# Altium schematic sheet UART Debug.SchDoc
size A4; SheetNumber: 2; SheetTotal: 12
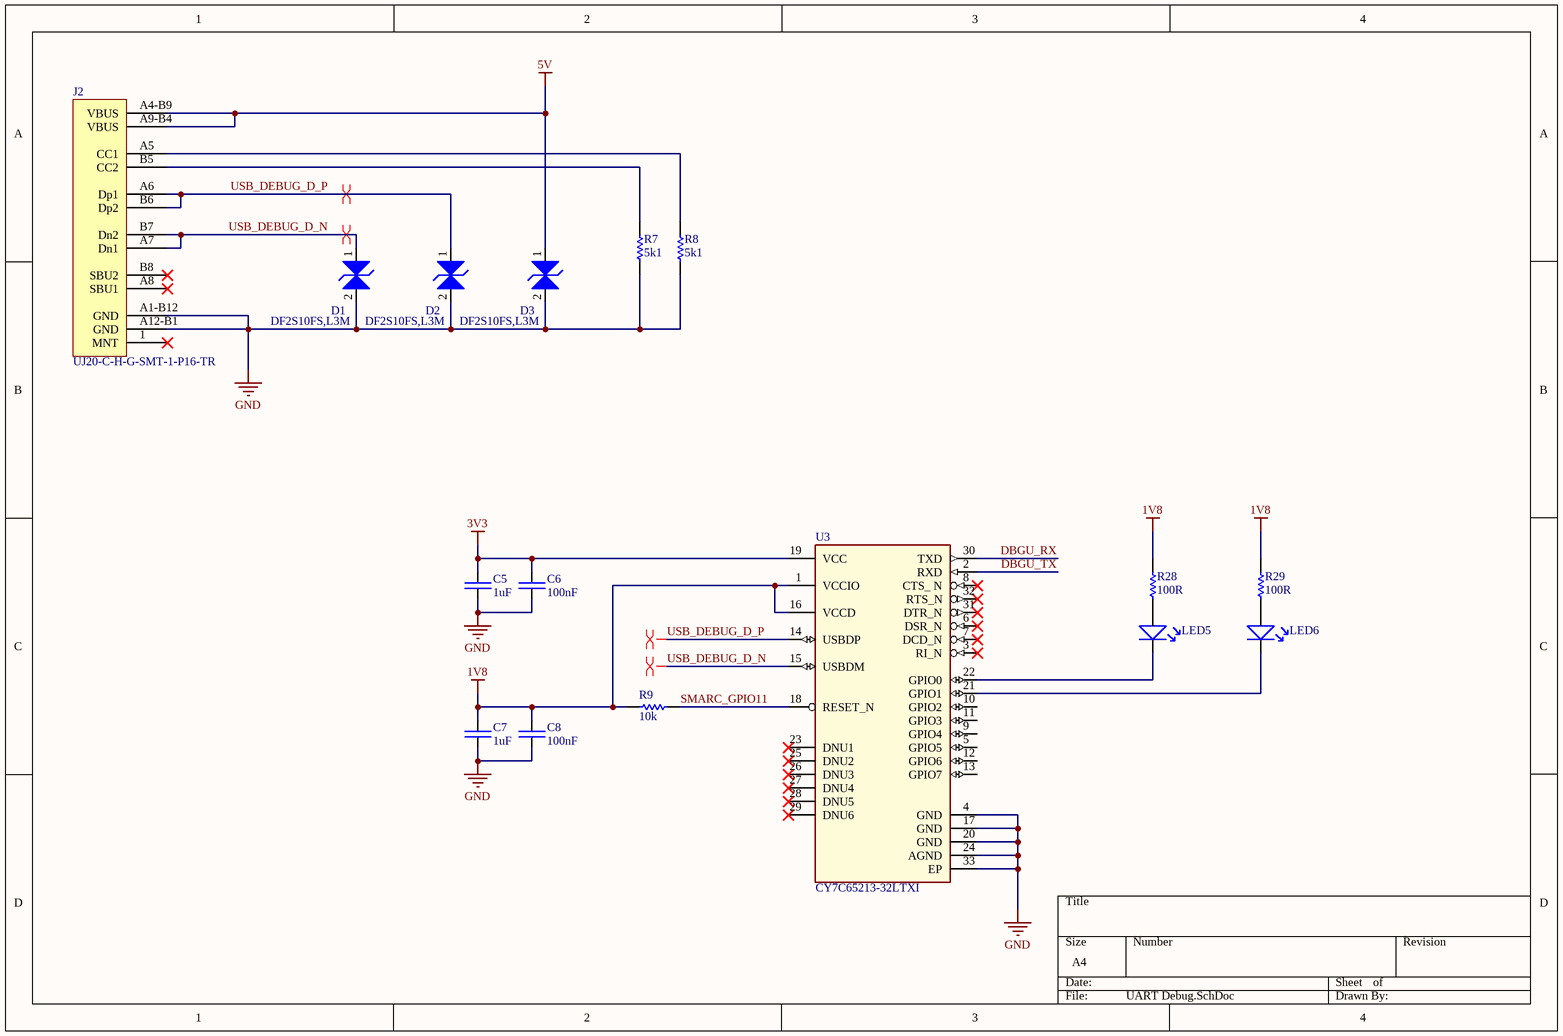
[diagram p0: UART Debug.SchDoc]

## Parts
C5  1uF  [CAP-0805]
C6  100nF  [CAP-0603]
C7  1uF  [CAP-0805]
C8  100nF  [CAP-0603]
D1  DF2S10FS,L3M  [DF2S10FS,L3M]
D2  DF2S10FS,L3M  [DF2S10FS,L3M]
D3  DF2S10FS,L3M  [DF2S10FS,L3M]
J2  UJ20-C-H-G-SMT-1-P16-TR  [UJ20-C-H-G-SMT-1-P16-TR]
LED5  0603 LED  [0603 LED]  (value not drawn)
LED6  0603 LED  [0603 LED]  (value not drawn)
R7  5k1  [RES-0603]
R8  5k1  [RES-0603]
R9  10k  [RES-0603]
R28  100R  [RES-0603]
R29  100R  [RES-0603]
U3  CY7C65213-32LTXI  [CY7C65213-32LTXI]

## Nets
1V8: C7.2 C8.2 R9.1 R28.2 R29.2 U3.1(VCCIO) U3.16(VCCD)
3V3: C5.2 C6.2 U3.19(VCC)
5V: D3.1 J2.A4-B9(VBUS) J2.A9-B4(VBUS)
GND: C5.1 C6.1 C7.1 C8.1 D1.2 D2.2 D3.2 J2.A1-B12(GND) J2.A12-B1(GND) R7.1 R8.1 U3.4(GND) U3.17(GND) U3.20(GND) U3.24(AGND) U3.33(EP)
DBGU_RX: U3.30(TXD)
DBGU_TX: U3.2(RXD)
SMARC_GPIO11: R9.2 U3.18(RESET_N)
USB_DEBUG_D_N: D1.1 J2.A7(Dn1) J2.B7(Dn2) U3.15(USBDM)
USB_DEBUG_D_P: D2.1 J2.A6(Dp1) J2.B6(Dp2) U3.14(USBDP)
NetJ2_A5: J2.A5(CC1) R8.2
NetJ2_B5: J2.B5(CC2) R7.2
NetLED5_1: LED5.1 R28.1
NetLED5_2: LED5.2 U3.22(GPIO0)
NetLED6_1: LED6.1 R29.1
NetLED6_2: LED6.2 U3.21(GPIO1)

Not connected (* = marked no-connect by the designer): J2 1(MNT)* A8(SBU1)* B8(SBU2)*; U3 3(RI_N)* 5(GPIO5) 6(DSR_N)* 7(DCD_N)* 8(CTS__N)* 9(GPIO4) 10(GPIO2) 11(GPIO3) 12(GPIO6) 13(GPIO7) 23(DNU1)* 25(DNU2)* 26(DNU3)* 27(DNU4)* 28(DNU5)* 29(DNU6)* 31(DTR_N)* 32(RTS_N)*

## Layout directives
differential pair: USB_DEBUG_D_N, USB_DEBUG_D_P

## Library data of the parts
C5 C7 = CAP-0805: Capacitor chip unpolarized. 0805
C6 C8 = CAP-0603: Capacitor chip unpolarized. 0603
D1-D3 = DF2S10FS,L3M: TVS Diode 8VRM
J2 = UJ20-C-H-G-SMT-1-P16-TR: USB-C Conn Surface Mount (16 + 8 Dummy)
R7-R9 R28 R29 = RES-0603: Resistor chip. 0603
U3 = CY7C65213-32LTXI: USB-UART LP Bridge Controller; Manufacturer: Infineon Technologies; Manufacturer Order Number: CY7C65213-32LTXI; PackageReference: QFN-32